# EAGLE design idate (EAGLE 6.1)

## Sheet 1 of 2
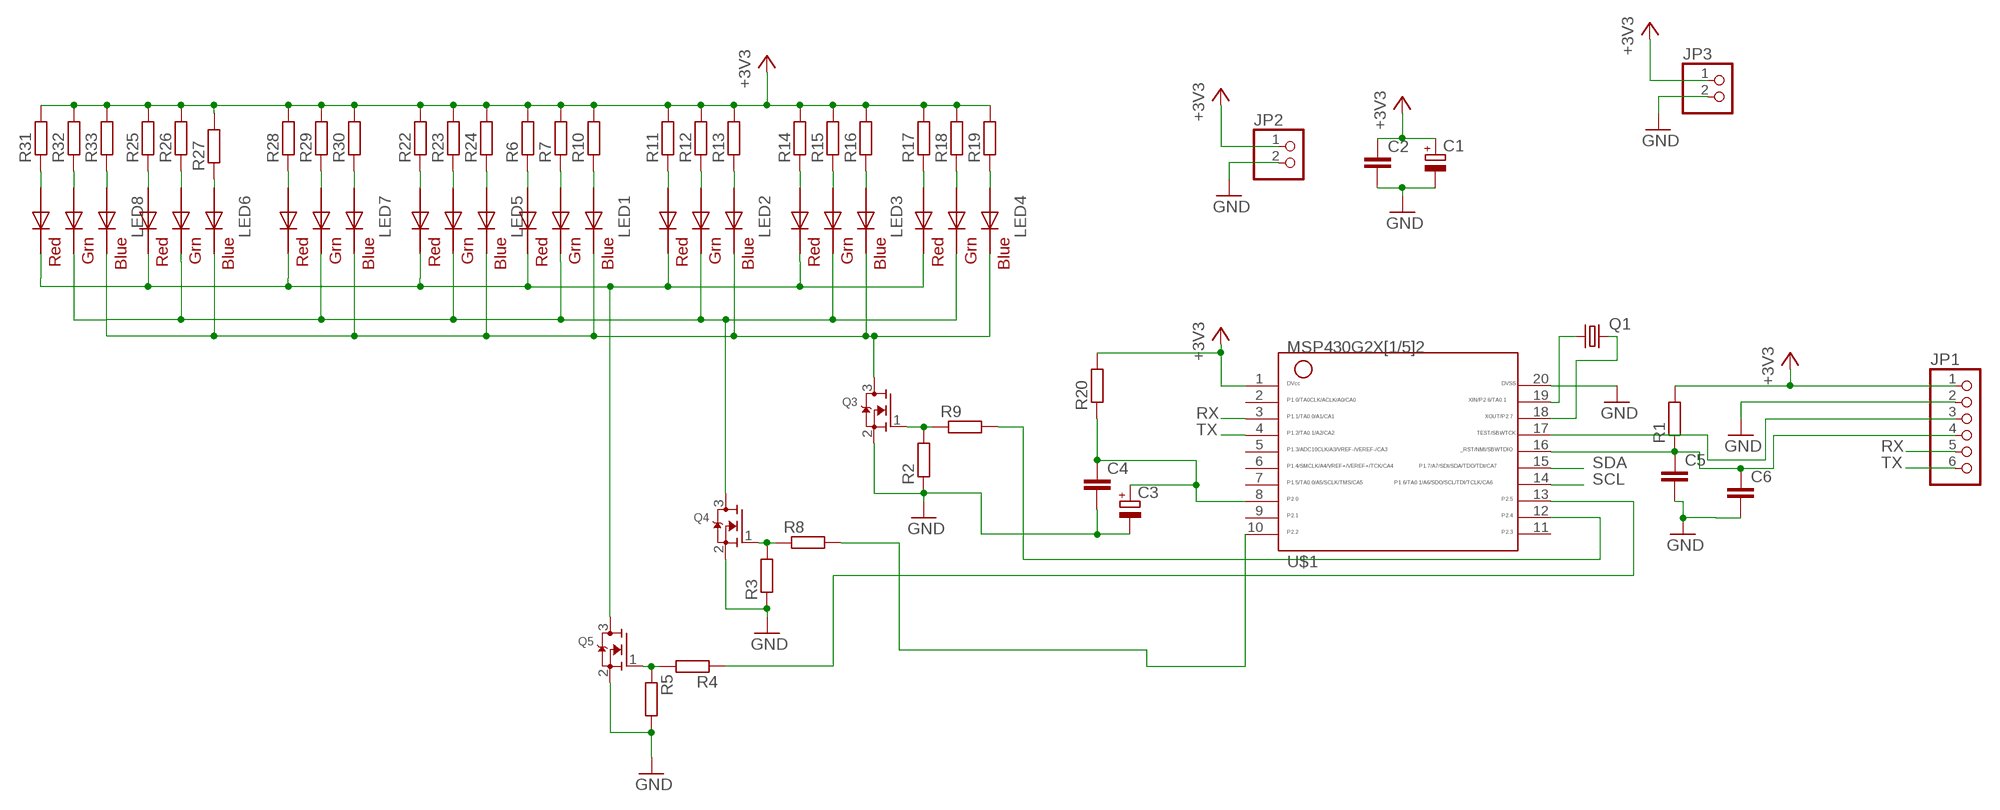
[diagram p0: schematic, sheet 1]

### Parts
C1  CPOL-EUE5-8.5  [E5-8,5]
C2  C-EU025-030X050  [C025-030X050]
C3  CPOL-EUTT2D6L  [TT2D6L]
C4  C-EUC0603  [C0603]
C5  C-EU050-024X044  [C050-024X044]
C6  C-EUC0603  [C0603]
JP1  HEADER-1X6  [1X06_OVAL]
JP2  HEADER-1X2  [1X02_OVAL]
JP3  HEADER-1X2  [1X02_OVAL]
LED1  RGBLED5050  [RGBLED5050]
LED2  RGBLED5050  [RGBLED5050]
LED3  RGBLED5050  [RGBLED5050]
LED4  RGBLED5050  [RGBLED5050]
LED5  RGBLED5050  [RGBLED5050]
LED6  RGBLED5050  [RGBLED5050]
LED7  RGBLED5050  [RGBLED5050]
LED8  RGBLED5050  [RGBLED5050]
Q1  CRYSTALTC26H  [TC26H]
Q3  MOSFET-NREFLOW  [SOT23]
Q4  MOSFET-NREFLOW  [SOT23]
Q5  MOSFET-NREFLOW  [SOT23]
R1  R-EU_0204/7  [0204/7]
R2  R-EU_0204/7  [0204/7]
R3  R-EU_0204/7  [0204/7]
R4  R-EU_0204/7  [0204/7]
R5  R-EU_0204/7  [0204/7]
R6  R-EU_0204/7  [0204/7]
R7  R-EU_0204/7  [0204/7]
R8  R-EU_0204/7  [0204/7]
R9  R-EU_0204/7  [0204/7]
R10  R-EU_0204/7  [0204/7]
R11  R-EU_0204/7  [0204/7]
R12  R-EU_0204/7  [0204/7]
R13  R-EU_0204/7  [0204/7]
R14  R-EU_0204/7  [0204/7]
R15  R-EU_0204/7  [0204/7]
R16  R-EU_0204/7  [0204/7]
R17  R-EU_0204/7  [0204/7]
R18  R-EU_0204/7  [0204/7]
R19  R-EU_0204/7  [0204/7]
R20  R-EU_0204/7  [0204/7]
R22  R-EU_0204/7  [0204/7]
R23  R-EU_0204/7  [0204/7]
R24  R-EU_0204/7  [0204/7]
R25  R-EU_0204/7  [0204/7]
R26  R-EU_0204/7  [0204/7]
R27  R-EU_0204/7  [0204/7]
R28  R-EU_0204/7  [0204/7]
R29  R-EU_0204/7  [0204/7]
R30  R-EU_0204/7  [0204/7]
R31  R-EU_0204/7  [0204/7]
R32  R-EU_0204/7  [0204/7]
R33  R-EU_0204/7  [0204/7]
U$1  G2X[1/5]2---N20  [N20]

### Nets
+3V3: C1.+ C2.1 JP1.1 JP2.1 JP3.1 R1.2 R6.2 R7.2 R10.2 R11.2 R12.2 R13.2 R14.2 R15.2 R16.2 R17.2 R18.2 R19.2 R20.2 R22.2 R23.2 R24.2 R25.2 R26.2 R27.2 R28.2 R29.2 R30.2 R31.2 R32.2 R33.2 U$1.1
BLUE: LED1.6(GREEN_C) LED2.6(GREEN_C) LED3.6(GREEN_C) LED4.6(GREEN_C) LED5.6(GREEN_C) LED6.6(GREEN_C) LED7.6(GREEN_C) LED8.6(GREEN_C) Q4.3(D)
GND: C1.- C2.2 C3.- C4.2 C5.2 C6.2 JP1.2 JP2.2 JP3.2 Q3.2(S) Q4.2(S) Q5.2(S) R2.1 R3.1 R5.2 U$1.20
N$1: JP1.3 U$1.17
N$2: Q5.1(G) R4.2 R5.1
N$3: Q1.1 U$1.19
N$4: Q4.1(G) R3.2 R8.1
N$5: R8.2 U$1.10
N$6: R4.1 U$1.13
N$7: C5.1 C6.1 JP1.4 R1.1 U$1.16
N$8: R9.2 U$1.12
N$9: Q3.1(G) R2.2 R9.1
N$11: Q1.2 U$1.18
N$12: LED1.2(RED_A) R6.1
N$13: LED1.1(GREEN_A) R7.1
N$14: LED1.3(BLUE_A) R10.1
N$15: LED2.2(RED_A) R11.1
N$16: LED2.1(GREEN_A) R12.1
N$17: LED2.3(BLUE_A) R13.1
N$18: LED3.2(RED_A) R14.1
N$20: LED3.1(GREEN_A) R15.1
N$21: LED3.3(BLUE_A) R16.1
N$22: LED4.2(RED_A) R17.1
N$23: LED4.1(GREEN_A) R18.1
N$24: LED4.3(BLUE_A) R19.1
N$25: LED5.3(BLUE_A) R24.1
N$28: LED6.3(BLUE_A) R27.1
N$29: LED7.2(RED_A) R28.1
N$30: LED7.1(GREEN_A) R29.1
N$31: C3.+ C4.1 R20.1 U$1.8
N$33: LED7.3(BLUE_A) R30.1
N$34: LED8.2(RED_A) R31.1
N$35: LED8.1(GREEN_A) R32.1
N$36: LED8.3(BLUE_A) R33.1
N$37: LED1.4(BLUE_C) LED2.4(BLUE_C) LED3.4(BLUE_C) LED4.4(BLUE_C) LED5.4(BLUE_C) LED6.4(BLUE_C) LED7.4(BLUE_C) LED8.4(BLUE_C) Q3.3(D)
N$106: LED5.2(RED_A) R22.1
N$190: LED5.1(GREEN_A) R23.1
N$268: LED6.2(RED_A) R25.1
N$276: LED6.1(GREEN_A) R26.1
RED: LED1.5(RED_C) LED2.5(RED_C) LED3.5(RED_C) LED4.5(RED_C) LED5.5(RED_C) LED6.5(RED_C) LED7.5(RED_C) LED8.5(RED_C) Q5.3(D)
RX: JP1.5 U$1.3
SCL: U$1.14
SDA: U$1.15
TX: JP1.6 U$1.4
Unconnected: U$1.2 U$1.5 U$1.6 U$1.7 U$1.9 U$1.11

## Sheet 2 of 2

## Library data of the parts
C1 C3 = rcl:CPOL-EU: POLARIZED CAPACITOR, European symbol
C2 C4-C6 = rcl:C-EU: CAPACITOR, European symbol
JP1 = microbuilder:HEADER-1X6: PIN HEADER
JP2 JP3 = microbuilder:HEADER-1X2: PIN HEADER
LED1-LED8 = adafruit:RGBLED: For 5050 RGB LEDs, the order of the LEDs may vary from one manufacturer to another!
Q1 = crystal:CRYSTAL: CRYSTAL; OC_FARNELL: unknown; OC_NEWARK: unknown
Q3-Q5 = adafruit:MOSFET-N: N-Channel Mosfet 2N7002E - 60V 260mA SOT23 [Digikey: 2N7002ET1GOSTR-ND] - REEL BSH103 - 30V 850mA SOT23 [Digikey: 568-5013-1-ND]
R1-R20 R22-R33 = rcl:R-EU_: RESISTOR, European symbol
U$1 = TI_MSP430_v16:G2X[1/5]2---N20: MSP430G2X[1/5]2 MSP430G2x52, MSP430G2x12 PDIP (N) 20 Pin Package http://focus.ti.com/docs/prod/folders/print/msp430g2452.html

## Board
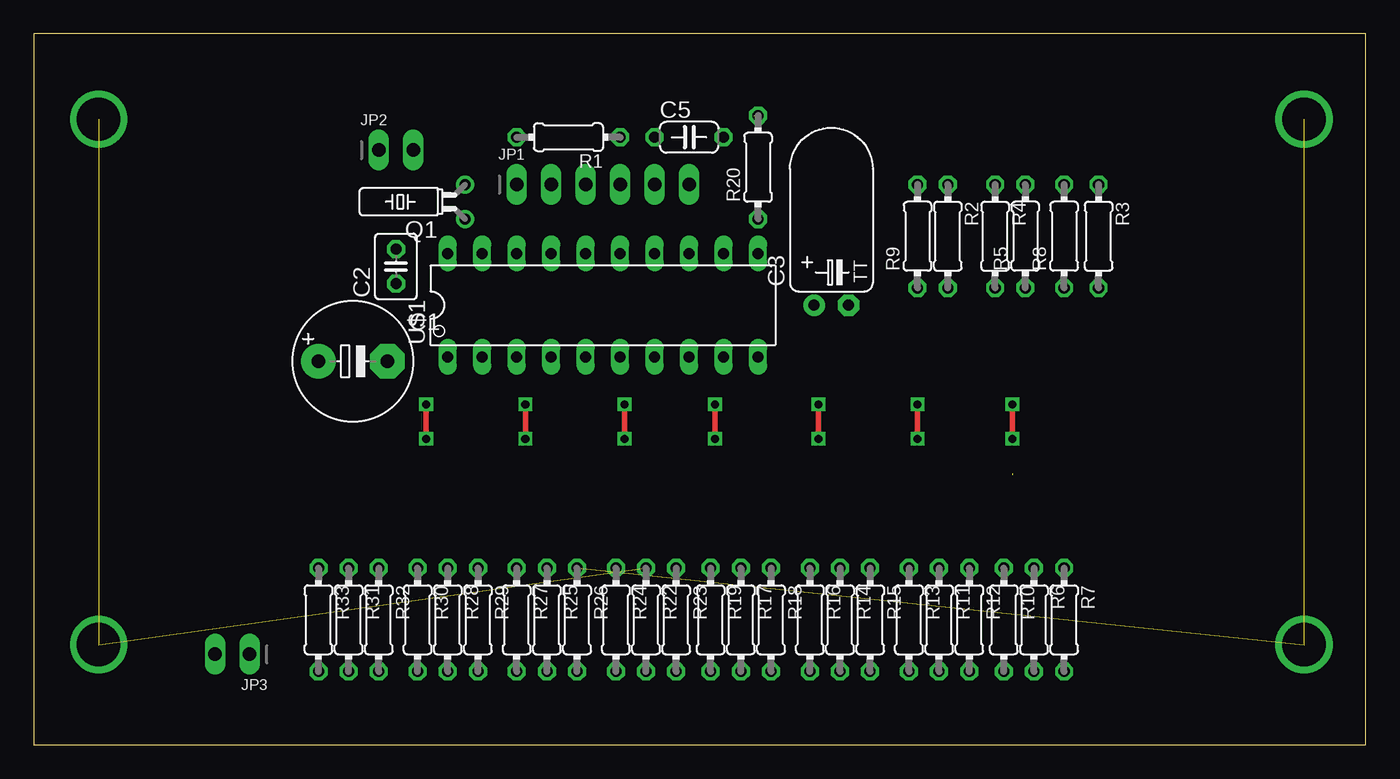
[diagram p1: board, top side]
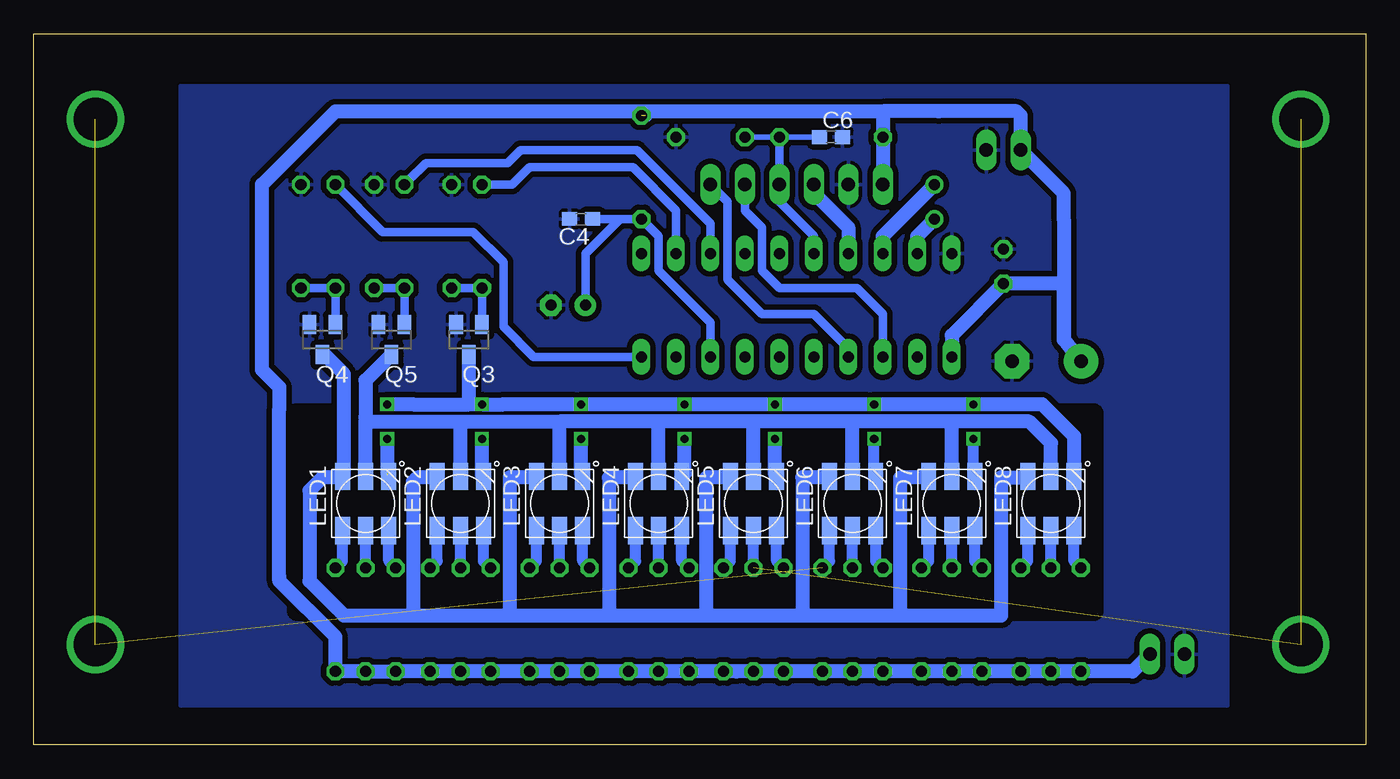
[diagram p2: board, bottom side, seen from below]

Size 98.09 x 52.38 mm. Coordinates in mm from the lower left corner, seen from the top.
Outline: 0,0 98.09,0 98.09,52.38 0,52.38 0,0
Copper layers (1*16): Top 0.035mm / dielectric 1.5mm / Bottom 0.035mm
Design rules: minimum track width 10mil, minimum drill 24mil, track to track 8mil, track to pad 8mil, pad to pad 8mil, via to via 8mil, smd to smd 8mil, copper to edge 40mil, drill to drill 8mil, minimum pad ring 10mil, minimum via ring 8mil, stop-mask expansion 4mil, vias tented up to drill 0mil, thermal gap 10mil
bRestrict: area 20,9.8 to 78.7,24.4

### Footprints (pad centres in the part's own frame; a part is rotated, then mirrored left to right if it is on the bottom)
E5-8,5 = drill 1.016 pad 2.54: + -2.54,0 | drill 1.016 pad 2.54 octagon: - 2.54,0
C025-030X050 = drill 0.813 octagon: 1 -1.27,0; 2 1.27,0
TT2D6L = drill 0.813 pad 1.6: + -1.27,0 | drill 0.813 pad 1.6 octagon: - 1.27,0
C0603 = smd 1.1 x 1: 1 -0.85,0; 2 0.85,0
C050-024X044 = drill 0.813 octagon: 1 -2.54,0; 2 2.54,0
1X06_OVAL = drill 1 long: 1 -6.35,0; 2 -3.81,0; 3 -1.27,0; 4 1.27,0; 5 3.81,0; 6 6.35,0
1X02_OVAL = drill 1 long: 1 -1.27,0; 2 1.27,0
RGBLED5050 = smd 2 x 1.1: 1 -2,1.7; 2 -2,0; 3 -2,-1.7; 4 2,-1.7; 5 2,0; 6 2,1.7
TC26H = drill 0.813: 1 -1.27,0; 2 1.27,0
SOT23 = smd 1 x 1.4: 1 -0.95,-1.1; 2 0.95,-1.1; 3 0,1.1
0204/7 = drill 0.813 octagon: 1 -3.81,0; 2 3.81,0
N20 = drill 0.813 long: 1 -11.435,-3.81; 2 -8.895,-3.81; 3 -6.355,-3.81; 4 -3.815,-3.81; 5 -1.275,-3.81; 6 1.265,-3.81; 7 3.805,-3.81; 8 6.345,-3.81; 9 8.885,-3.81; 10 11.425,-3.81; 11 11.425,3.81; 12 8.885,3.81; 13 6.345,3.81; 14 3.805,3.81; 15 1.265,3.81; 16 -1.275,3.81; 17 -3.815,3.81; 18 -6.355,3.81; 19 -8.895,3.81; 20 -11.435,3.81

### Placement (x,y rotation side)
C1  23.49,28.26 0 top
C2  26.67,35.24 90 top
C3  58.74,32.39 0 top
C4  57.78,38.73 180 bottom
C5  48.26,44.77 0 top
C6  39.37,44.77 0 bottom
JP1  41.91,41.27 0 top
JP2  26.67,43.81 0 top
JP3  14.61,6.67 180 top
LED1  73.66,17.78 90 bottom
LED2  66.67,17.78 90 bottom
LED3  59.37,17.78 90 bottom
LED4  52.07,17.78 90 bottom
LED5  45.09,17.78 90 bottom
LED6  37.78,17.78 90 bottom
LED7  30.48,17.78 90 bottom
LED8  23.18,17.78 90 bottom
Q1  31.75,40 90 top
Q3  66.04,29.85 180 bottom
Q4  76.83,29.85 180 bottom
Q5  71.75,29.85 180 bottom
R1  39.37,44.77 180 top
R2  67.31,37.47 270 top
R3  78.42,37.47 270 top
R4  70.8,37.47 270 top
R5  73.03,37.47 90 top
R6  73.66,9.21 270 top
R7  75.88,9.21 270 top
R8  75.88,37.47 90 top
R9  65.09,37.47 90 top
R10  71.44,9.21 270 top
R11  66.67,9.21 270 top
R12  68.9,9.21 270 top
R13  64.45,9.21 270 top
R14  59.37,9.21 270 top
R15  61.59,9.21 270 top
R16  57.15,9.21 270 top
R17  52.07,9.21 270 top
R18  54.29,9.21 270 top
R19  49.85,9.21 270 top
R20  53.34,42.55 90 top
R22  45.09,9.21 270 top
R23  47.31,9.21 270 top
R24  42.86,9.21 270 top
R25  37.78,9.21 270 top
R26  40.01,9.21 270 top
R27  35.56,9.21 270 top
R28  30.48,9.21 270 top
R29  32.7,9.21 270 top
R30  28.26,9.21 270 top
R31  23.18,9.21 270 top
R32  25.4,9.21 270 top
R33  20.95,9.21 270 top
U$1  41.91,32.39 0 top

### Tracks (layer width: path | path; a pad name or v marks a point on that pad's centre or on a via)
+3V3  (1 unrouted)
  Bottom 0.406: 80.01,24.77 80.01,25.08 80.01,24.77
  Bottom 1.016: 22.22,29.85 C1.+ 22.22,29.85 | 22.22,29.85 22.22,33.97 | 22.22,33.97 22.22,34.29 | 22.22,34.29 22.22,33.97 | 22.22,33.97 C2.1 30.48,30.16 U$1.1 | JP1.1 R1.2 35.56,46.67 | 35.56,46.67 31.43,46.67 25.72,46.67 25.4,46.36 JP2.1 22.22,40.64 22.22,38.74 22.22,34.29 | 22.22,34.29 22.22,33.97 | 22.22,33.97 22.22,29.85 | 53.02,46.67 73.66,46.67 75.88,46.67 78.9,43.66 81.28,41.27 81.28,27.62 80.01,26.35 80.01,25.08 80.01,24.77 80.01,12.38 80.01,12.07 75.88,7.94 R7.2 R6.2 R10.2 R12.2 R11.2 R13.2 R15.2 R14.2 R16.2 R18.2 R17.2 R19.2 R23.2 46.35,5.4 R22.2 R24.2 R26.2 R25.2 R27.2 R29.2 R28.2 R30.2 R32.2 R31.2 R33.2 17.14,5.4 JP3.1 | 53.02,46.67 53.02,46.36 53.34,46.67 | 53.02,46.67 35.56,46.67
BLUE
  Bottom 0.406: LED1.6 75.25,19.89 75.45,19.68 | 26.99,9.53 26.83,9.53 | 24.88,19.57 LED8.6 | LED3.6 61.17,19.68 | LED4.6 53.87,19.68 | LED5.6 46.88,19.68 | LED6.6 39.58,19.68 | LED7.6 32.27,19.68 | 76.83,28.89 Q4.3
  Bottom 1.016: 75.25,19.89 75.25,27.31 76.83,28.89 | 75.45,19.68 76.83,19.68 77.79,18.73 77.79,12.07 75.25,9.53 70.17,9.53 | 70.17,9.53 63.04,9.55 | 63.04,9.55 55.74,9.53 | 55.74,9.53 48.58,9.53 | 48.58,9.53 41.49,9.55 | 41.49,9.55 34.29,9.53 | 34.29,9.53 26.99,9.53 | 26.83,9.53 26.84,19.71 25.08,19.68 25.08,19.57 24.88,19.57 | 61.17,19.68 63.04,19.71 63.04,9.55 | 53.87,19.68 55.74,19.68 55.74,9.53 | 46.88,19.68 48.58,19.68 48.58,9.53 | 39.58,19.68 41.27,19.68 41.49,19.71 41.49,9.55 | 32.27,19.68 33.97,19.68 34.29,19.68 34.29,9.53 | LED2.6 68.47,19.68 69.85,19.68 70.17,19.37 70.17,9.53
GND
  pour Bottom (isolate 0.406): 87.31,48.58 87.31,2.86 10.16,2.86 10.16,48.58
N$1
  Bottom 1.016: JP1.3 40.64,40.64 38.1,38.11 U$1.17
N$2
  Bottom 0.406: Q5.1 70.8,30.63
  Bottom 0.61: R5.1 R4.2 70.8,30.63
N$3
  Bottom 1.016: U$1.19 33.02,37.47 Q1.1
N$4
  Bottom 0.406: Q4.1
  Bottom 0.61: R3.2 R8.1 Q4.1
N$5
  Bottom 0.61: U$1.10 61.28,28.57 63.5,30.8 63.5,32.07 63.5,35.56 65.72,37.78 72.39,37.78 R8.2
N$6
  Bottom 0.406: U$1.13
  Bottom 0.61: U$1.13 48.26,38.42 53.66,43.82 62.23,43.82 63.18,42.86 69.22,42.86 70.48,41.59 R4.1
N$7
  Bottom 0.406: U$1.16 | C5.1 R1.1 C6.1
  Bottom 0.61: U$1.16 40.64,37.47 43.18,40 JP1.4 R1.1
N$8
  Bottom 0.61: U$1.12 50.8,39.37 53.98,42.55 61.59,42.55 62.87,41.27 R9.2
N$9
  Bottom 0.61: Q3.1 65.09,33.34 R9.1 R2.2
N$11
  Bottom 0.406: 34.29,38.74 Q1.2 34.29,38.74
  Bottom 1.016: Q1.2 34.29,38.74 35.56,37.47 U$1.18
N$12
  Bottom 0.813: R6.1 LED1.2
N$13
  Bottom 0.813: R7.1 75.36,13.54 LED1.1
N$14
  Bottom 0.813: R10.1 71.96,13.54 LED1.3
N$15
  Bottom 0.813: R11.1 LED2.2
N$16
  Bottom 0.813: R12.1 68.38,13.54 LED2.1
N$17
  Bottom 0.813: R13.1 64.98,13.54 LED2.3
N$18
  Bottom 0.813: R14.1 LED3.2
N$20
  Bottom 0.813: R15.1 61.07,13.54 LED3.1
N$21
  Bottom 0.813: R16.1 57.67,13.54 LED3.3
N$22
  Bottom 0.813: R17.1 LED4.2
N$23
  Bottom 0.813: R18.1 53.77,13.54 LED4.1
N$24
  Bottom 0.813: R19.1 50.37,13.54 LED4.3
N$25
  Bottom 0.813: R24.1 43.38,13.54 LED5.3
N$28
  Bottom 0.813: R27.1 36.08,13.54 LED6.3
N$29
  Bottom 0.813: R28.1 LED7.2
N$30
  Bottom 0.813: R29.1 32.18,13.54 LED7.1
N$31
  Bottom 0.406: U$1.8
  Bottom 0.61: U$1.8 48.26,31.11 52.07,34.92 52.07,37.47 R20.1 54.93,38.74 | 54.93,38.74 57.47,36.2 57.47,35.56 C3.+ | C4.1 54.93,38.74
N$33
  Bottom 0.813: R30.1 28.78,13.54 LED7.3
N$34
  Bottom 0.813: R31.1 LED8.2
N$35
  Bottom 0.813: R32.1 24.88,13.54 LED8.1
N$36
  Bottom 0.813: R33.1 21.48,13.54 LED8.3
N$37  (via drill 0.6)  (1 unrouted)
  Top 0.406: v28.89,22.54 v28.89,25.08 | v36.2,22.54 v36.2,25.08 | v43.5,22.54 v43.5,25.08 | v50.16,22.54 v50.16,25.08 | v57.78,22.54 v57.78,25.08 | v65.09,22.54 v65.09,25.08 | v72.07,25.08 v72.07,22.54
  Bottom 0.406: LED8.4 21.59,19.89 | v28.89,25.08 30.16,25.08 | v43.5,25.08 44.77,25.08 | v50.16,25.08 51.44,25.08 | 63.5,25.08 v65.09,25.08 | LED1.4 72.07,19.89 | LED2.4 65.09,19.89 | LED7.4 28.89,19.89 | LED6.4 36.2,19.89 | LED5.4 43.5,19.89 | LED4.4 50.16,19.99 | LED3.4 57.78,19.89 | 72.07,20 72.07,19.68 | v36.2,25.08 36.83,25.08 v36.2,25.08 | v57.78,25.08 58.42,25.08 v57.78,25.08
  Bottom 0.813: 28.89,19.89 v28.89,22.54 | 36.2,19.89 v36.2,22.54
  Bottom 1.016: v36.2,25.08 30.16,25.08 v28.89,25.08 23.81,25.08 21.48,22.75 LED8.4 | 36.83,25.08 v43.5,25.08 44.77,25.08 v50.16,25.08 51.44,25.08 v57.78,25.08 | 58.42,25.08 63.5,25.08 v65.09,25.08 66.04,25.08 | 66.04,25.08 66.04,26.67 Q3.3 | 66.04,25.08 70.17,25.08 v72.07,25.08 | 43.5,19.89 v43.5,22.54 | 50.16,19.99 v50.16,22.54 | 57.78,19.89 v57.78,22.54 | 65.09,19.89 v65.09,22.54 | v72.07,22.54 72.07,20
N$106  (via drill 3.2)  (2 unrouted)
  Bottom 0.813: R22.1 LED5.2
  other vias: 4.76,46.09 4.76,7.38
N$190
  Bottom 0.813: R23.1 46.78,13.54 LED5.1
N$268
  Bottom 0.813: R25.1 LED6.2
N$276  (via drill 3.2)  (2 unrouted)
  Bottom 0.813: R26.1 39.48,13.54 LED6.1
  other vias: 93.56,46.09 93.56,7.38
RED
  Bottom 0.406: 73.66,24.13 73.66,23.81 73.66,24.13
  Bottom 1.016: LED3.5 59.37,23.81 | LED8.5 23.18,22.22 24.77,23.81 30.48,23.81 | 30.48,23.81 37.78,23.81 | 37.78,23.81 45.09,23.81 | 45.09,23.81 52.07,23.81 | 52.07,23.81 59.37,23.81 | LED2.5 66.67,23.81 | 66.67,23.81 59.37,23.81 | LED7.5 30.48,23.81 | LED6.5 37.78,23.81 | Q5.3 73.66,26.84 73.66,24.13 | 66.67,23.81 73.66,23.81 73.66,22.54 LED1.5 | LED4.5 52.07,23.81 | LED5.5 45.09,23.81
RX
  Bottom 0.406: U$1.3
  Bottom 0.61: JP1.5 45.72,39.37 44.45,38.1 44.45,34.92 43.18,33.66 37.46,33.66 35.56,31.75 U$1.3
TX
  Bottom 0.61: U$1.4 38.09,29.21 40.64,31.75 44.45,31.75 46.99,34.29 46.99,40 JP1.6